# Altium schematic sheet programmer.SchDoc
size A4; SheetNumber: 25; SheetTotal: 25
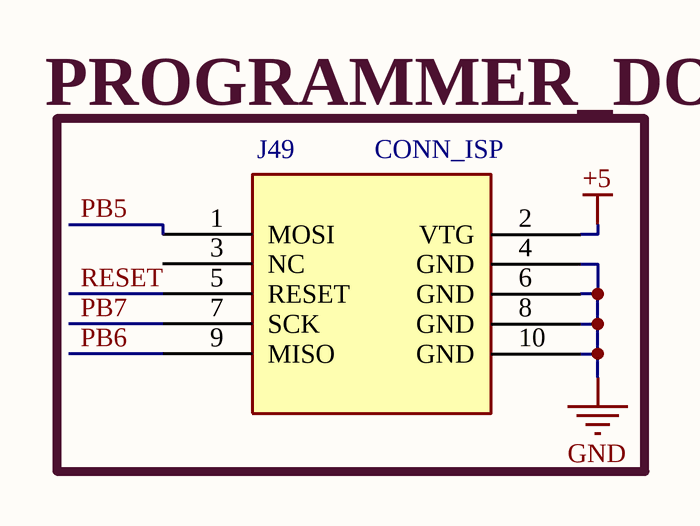
[diagram p0: programmer.SchDoc]

## Parts
J49  CONN_ISP  [IDC_2X5]

## Nets
+5: J49.2(VTG)
GND: J49.4(GND) J49.6(GND) J49.8(GND) J49.10(GND)
PB5: J49.1(MOSI)
PB6: J49.9(MISO)
PB7: J49.7(SCK)
RESET: J49.5(RESET)

Not connected (* = marked no-connect by the designer): J49 3(NC)

## Notes on the sheet
- (near J49) PROGRAMMER_DONE

## Library data of the parts
J49 = CONN_AVR_ISP_IDC10: CONN, ISP, AVR; VALUE: CONN_ISP